# Altium schematic sheet joint_board_boosterpack.SchDoc
size A; Engineer: Ben Titus; DocumentNumber: 1; Revision: 1.0; SheetNumber: 1
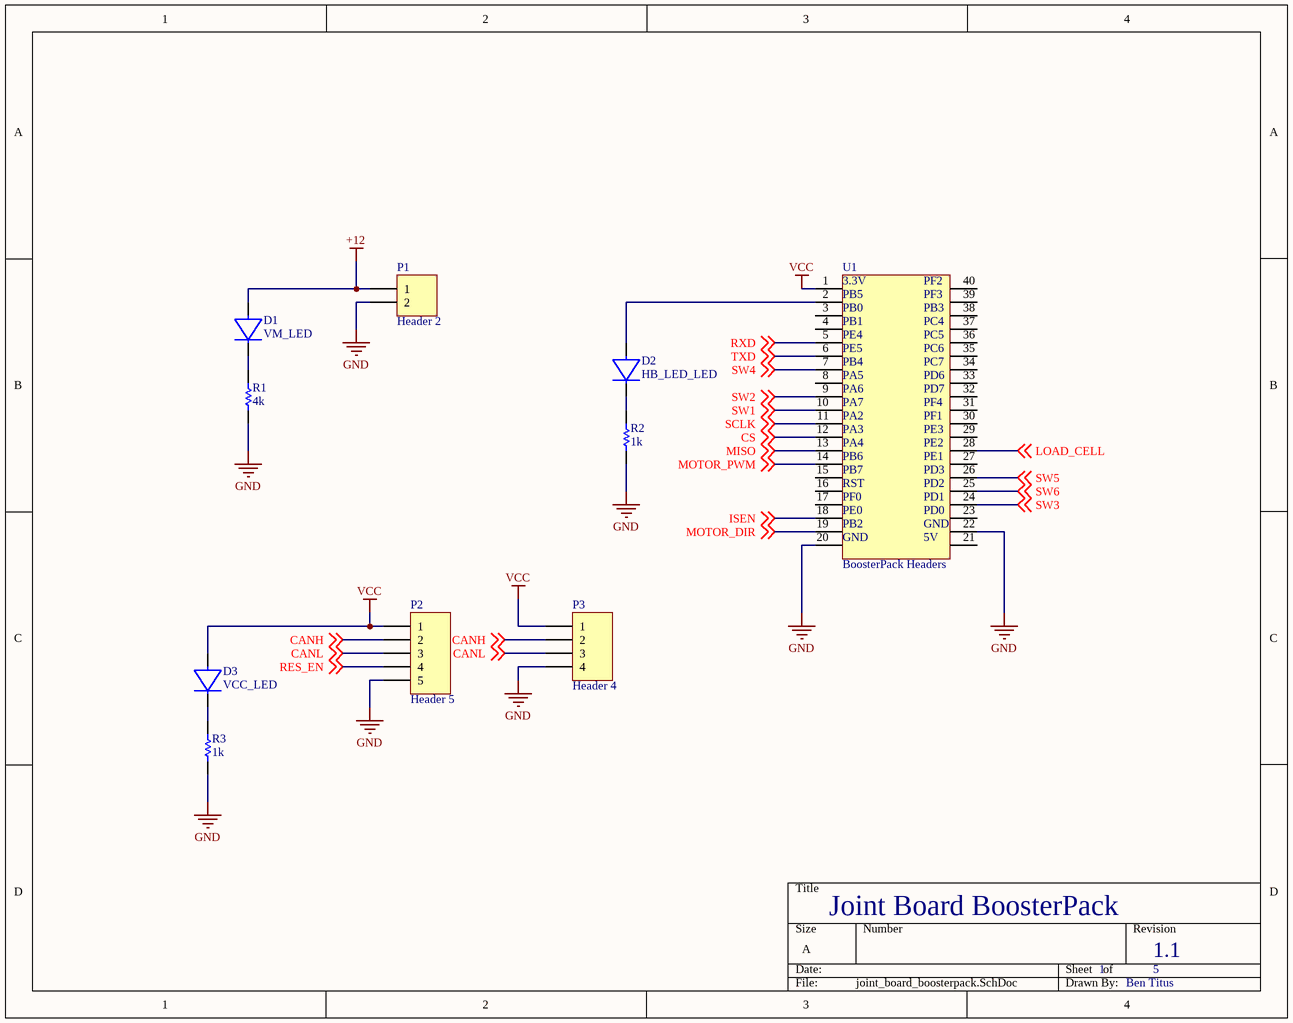
[diagram p0: joint_board_boosterpack.SchDoc]

## Parts
D1  VM_LED  [0805 Diode]
D2  HB_LED_LED  [0805 Diode]
D3  VCC_LED  [0805 Diode]
P1  Header 2  [HDR1X2]
P2  Header 5  [HDR1X5]
P3  Header 4  [HDR1X4]
R1  4k  [RESC0805(2012)_L]
R2  1k  [RESC0805(2012)_L]
R3  1k  [RESC0805(2012)_L]
U1  BoosterPack Headers  [boosterpack_headers]

## Nets
+12: D1.1 P1.1
GND: P1.2 P2.5 P3.4 R1.1 R2.1 R3.1 U1.20 U1.22
VCC: D3.1 P2.1 P3.1 U1.1
CANH: P2.2 P3.2 ; off-sheet CANH
CANL: P2.3 P3.3 ; off-sheet CANL
CS: U1.12 ; off-sheet CS
ISEN: U1.18 ; off-sheet ISEN
LOAD_CELL: U1.28 ; off-sheet LOAD_CELL
MISO: U1.13 ; off-sheet MISO
MOTOR_DIR: U1.19 ; off-sheet MOTOR_DIR
MOTOR_PWM: U1.14 ; off-sheet MOTOR_PWM
RES_EN: P2.4 ; off-sheet RES_EN
RXD: U1.5 ; off-sheet RXD
SCLK: U1.11 ; off-sheet SCLK
SW1: U1.10 ; off-sheet SW1
SW2: U1.9 ; off-sheet SW2
SW3: U1.24 ; off-sheet SW3
SW4: U1.7 ; off-sheet SW4
SW5: U1.26 ; off-sheet SW5
SW6: U1.25 ; off-sheet SW6
TXD: U1.6 ; off-sheet TXD
NetD1_2: D1.2 R1.2
NetD2_1: D2.1 U1.2
NetD2_2: D2.2 R2.2
NetD3_2: D3.2 R3.2

Not connected (* = marked no-connect by the designer): U1 3 4 8 15 16 17 21 23 27 29 30 31 32 33 34 35 36 37 38 39 40

## Notes on the sheet
- Joint Board BoosterPack
- 1
- 1.1
- 5
- Ben Titus
- (in symbol BoosterPack Headers) 3.3V; PF2; PB5; PF3; PB0; PB3; PB1; PC4; PE4; PC5; PE5; PC6; PB4; PC7; PA5; PD6; PA6; PD7; PA7; PF4; PA2; PF1; PA3; PE3; PA4; PE2; PB6; PE1; PB7; PD3; RST; PD2; PF0; PD1; PE0; PD0; PB2; GND; 5V

## Library data of the parts
D1-D3 = SMD_LED
P1 = Header 2: Header, 2-Pin; LatestRevisionDate: 17-Jul-2002; LatestRevisionNote: Re-released for DXP Platform.; Publisher: Altium Limited
P2 = Header 5: Header, 5-Pin; LatestRevisionDate: 17-Jul-2002; LatestRevisionNote: Re-released for DXP Platform.; Publisher: Altium Limited
P3 = Header 4: Header, 4-Pin; LatestRevisionDate: 17-Jul-2002; LatestRevisionNote: Re-released for DXP Platform.; Publisher: Altium Limited
R1-R3 = CMP-1591-00002-1: 0805 (2012 Metric) Chip Resistor; Case-EIA: 0805; Case-Metric: 2012; PackageReference: RESC0805(2012)